# Altium project 101000100.PrjPcb
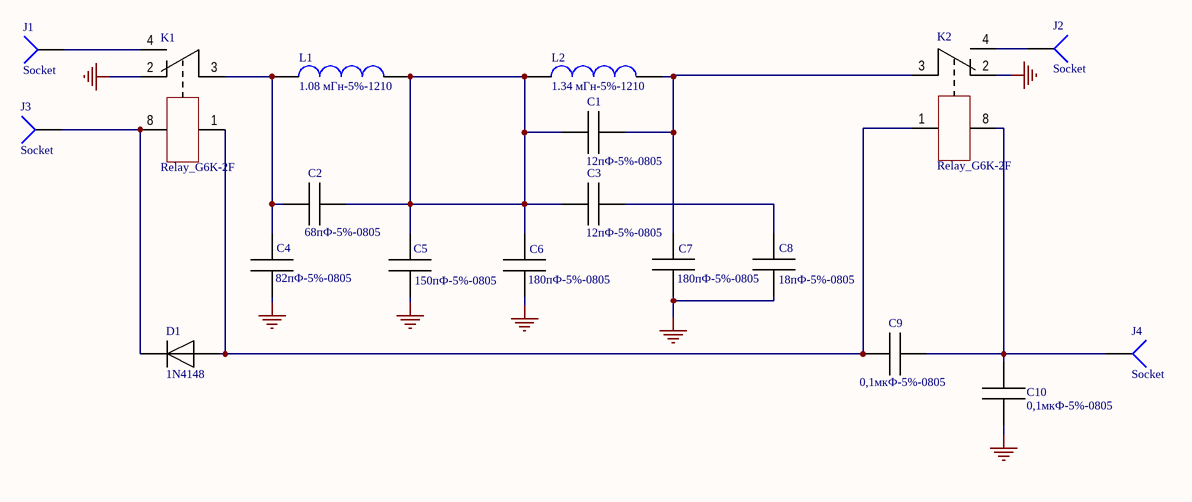
[diagram p0: Sheet1.SchDoc]
1 sheet, 19 parts. Net scope: global (net labels, ports and power ports of the same name join across sheets).
Board files: PCB1.PcbDoc, PCB3.PcbDoc

## Sheet Sheet1.SchDoc: Фильтр
size 420 x 297 mm; CheckedBy: Бойков; Author: Кудаков; CompanyName: РРБО-02-24; Address1: Address1; Address2: Address2; Address3: Address3; Address4: Address4; DocumentNumber: МРАГ.1122.1000 Э3; SheetNumber: 1; Title2str: 10/14 мГц; DocumentType: Схема электрическая принципиальная; FirstReferrence: МРАГ.1122.1000

### Parts
C1  12пФ-5%-0805  [Capacitor_0805]
C2  68пФ-5%-0805  [Capacitor_0805]
C3  12пФ-5%-0805  [Capacitor_0805]
C4  82пФ-5%-0805  [Capacitor_0805]
C5  150пФ-5%-0805  [Capacitor_0805]
C6  180пФ-5%-0805  [Capacitor_0805]
C7  180пФ-5%-0805  [Capacitor_0805]
C8  18пФ-5%-0805  [Capacitor_0805]
C9  0,1мкФ-5%-0805  [Capacitor_0805]
C10  0,1мкФ-5%-0805  [Capacitor_0805]
D1  1N4148  [1N4148_MELF]
J1  Socket  [PIN1]
J2  Socket  [PIN1]
J3  Socket  [PIN1]
J4  Socket  [PIN1]
K1  Relay_G6K-2F  [Relay_G6K-2F]
K2  Relay_G6K-2F  [Relay_G6K-2F]
L1  1.08 мГн-5%-1210  [Inductor_1210L]
L2  1.34 мГн-5%-1210  [Inductor_1210L]

### Nets
NetC4_0: C4.0 C5.0 C6.0 C7.0 C8.0 C10.0 K1.2 K2.2
NetC1_0: C1.0 C2.1 C3.0 C5.1 C6.1 L1.2 L2.1
NetC1_1: C1.1 C3.1 C7.1 C8.1 K2.3 L2.2
NetC2_0: C2.0 C4.1 K1.3 L1.1
NetC9_0: C9.0 D1.1 K1.1(plus) K2.1(plus)
NetC9_1: C9.1 C10.1 J4.1 K2.8(minus)
NetD1_2: D1.2 J3.1 K1.8(minus)
NetJ1_1: J1.1 K1.4
NetJ2_1: J2.1 K2.4

### Notes on the sheet
- Перв. примен.
- Справ. №
- Подп. и дата
- Инв. № дубл.
- Взам. инв. №
- Разраб.
- Изм.
- Лист
- № докум.
- Подп.
- Дата
- Лит.
- Масса
- Масштаб
- Пров.
- Т.контр.
- Листов
- Инв. № подл.
- Утв.
- Н.контр.
- 2.106-A3
- Копировал
- Формат А3

### Library data of the parts
C1 C3 = Capasitor_0805: PartNumber: GRM2195C2D120JV01D; Manufacturer: Murata Electronics; Href: https://www.chipdip.ru/product/grm2195c2d120j?from=suggest_product
C2 = Capasitor_0805: PartNumber: GRM2165C1H680JZ01D; Manufacturer: Murata Electronics; Href: https://www.chipdip.ru/product/grm2165c1h680j?from=suggest_product
C4 = Capasitor_0805: PartNumber: GRM2165C1H820JZ01D; Manufacturer: Murata Electronics; Href: https://www.chipdip.ru/product/grm2165c1h820j?from=suggest_product
C5 = Capasitor_0805: PartNumber: GRM2165C1H151JA01D; Manufacturer: Murata Electronics; Href: https://www.chipdip.ru/product/grm2165c1h151j?from=suggest_product
C6 C7 = Capasitor_0805: PartNumber: GRM2165C1H181JA01D; Manufacturer: Murata Electronics; Href: https://www.chipdip.ru/product/grm2165c1h181j?from=suggest_product
C8 = Capasitor_0805: PartNumber: GRM2165C1H180JZ01D; Manufacturer: Murata Electronics; Href: https://www.chipdip.ru/product/grm2165c1h180j?from=suggest_product
C9 C10 = Capasitor_0805: PartNumber: GRM21BR71E104KA01L; Manufacturer: Murata Electronics; Href: https://www.chipdip.ru/product/grm21br71e104ka01l?from=suggest_product
D1 = Diode_1N4148: Manufacturer: *; Href: *; PartNumber: *; Value: 1N4148
L1 = Inductor_1210: Manufacturer: TAI-TECH; PartNumber: PASU 3225V-102J; Href: https://www.chipdip.ru/product0/8034051211
L2 = Inductor_1210: Manufacturer: TAI-TECH; PartNumber: PASU 3225V-132J; Href: https://www.chipdip.ru/product0/8033890628
J1-J4 = Socket: LatestRevisionDate: 17-Jul-2002; LatestRevisionNote: Re-released for DXP Platform.; Publisher: Altium Limited